# Altium project PCB_Project.PrjPcb (part 9 of 11)
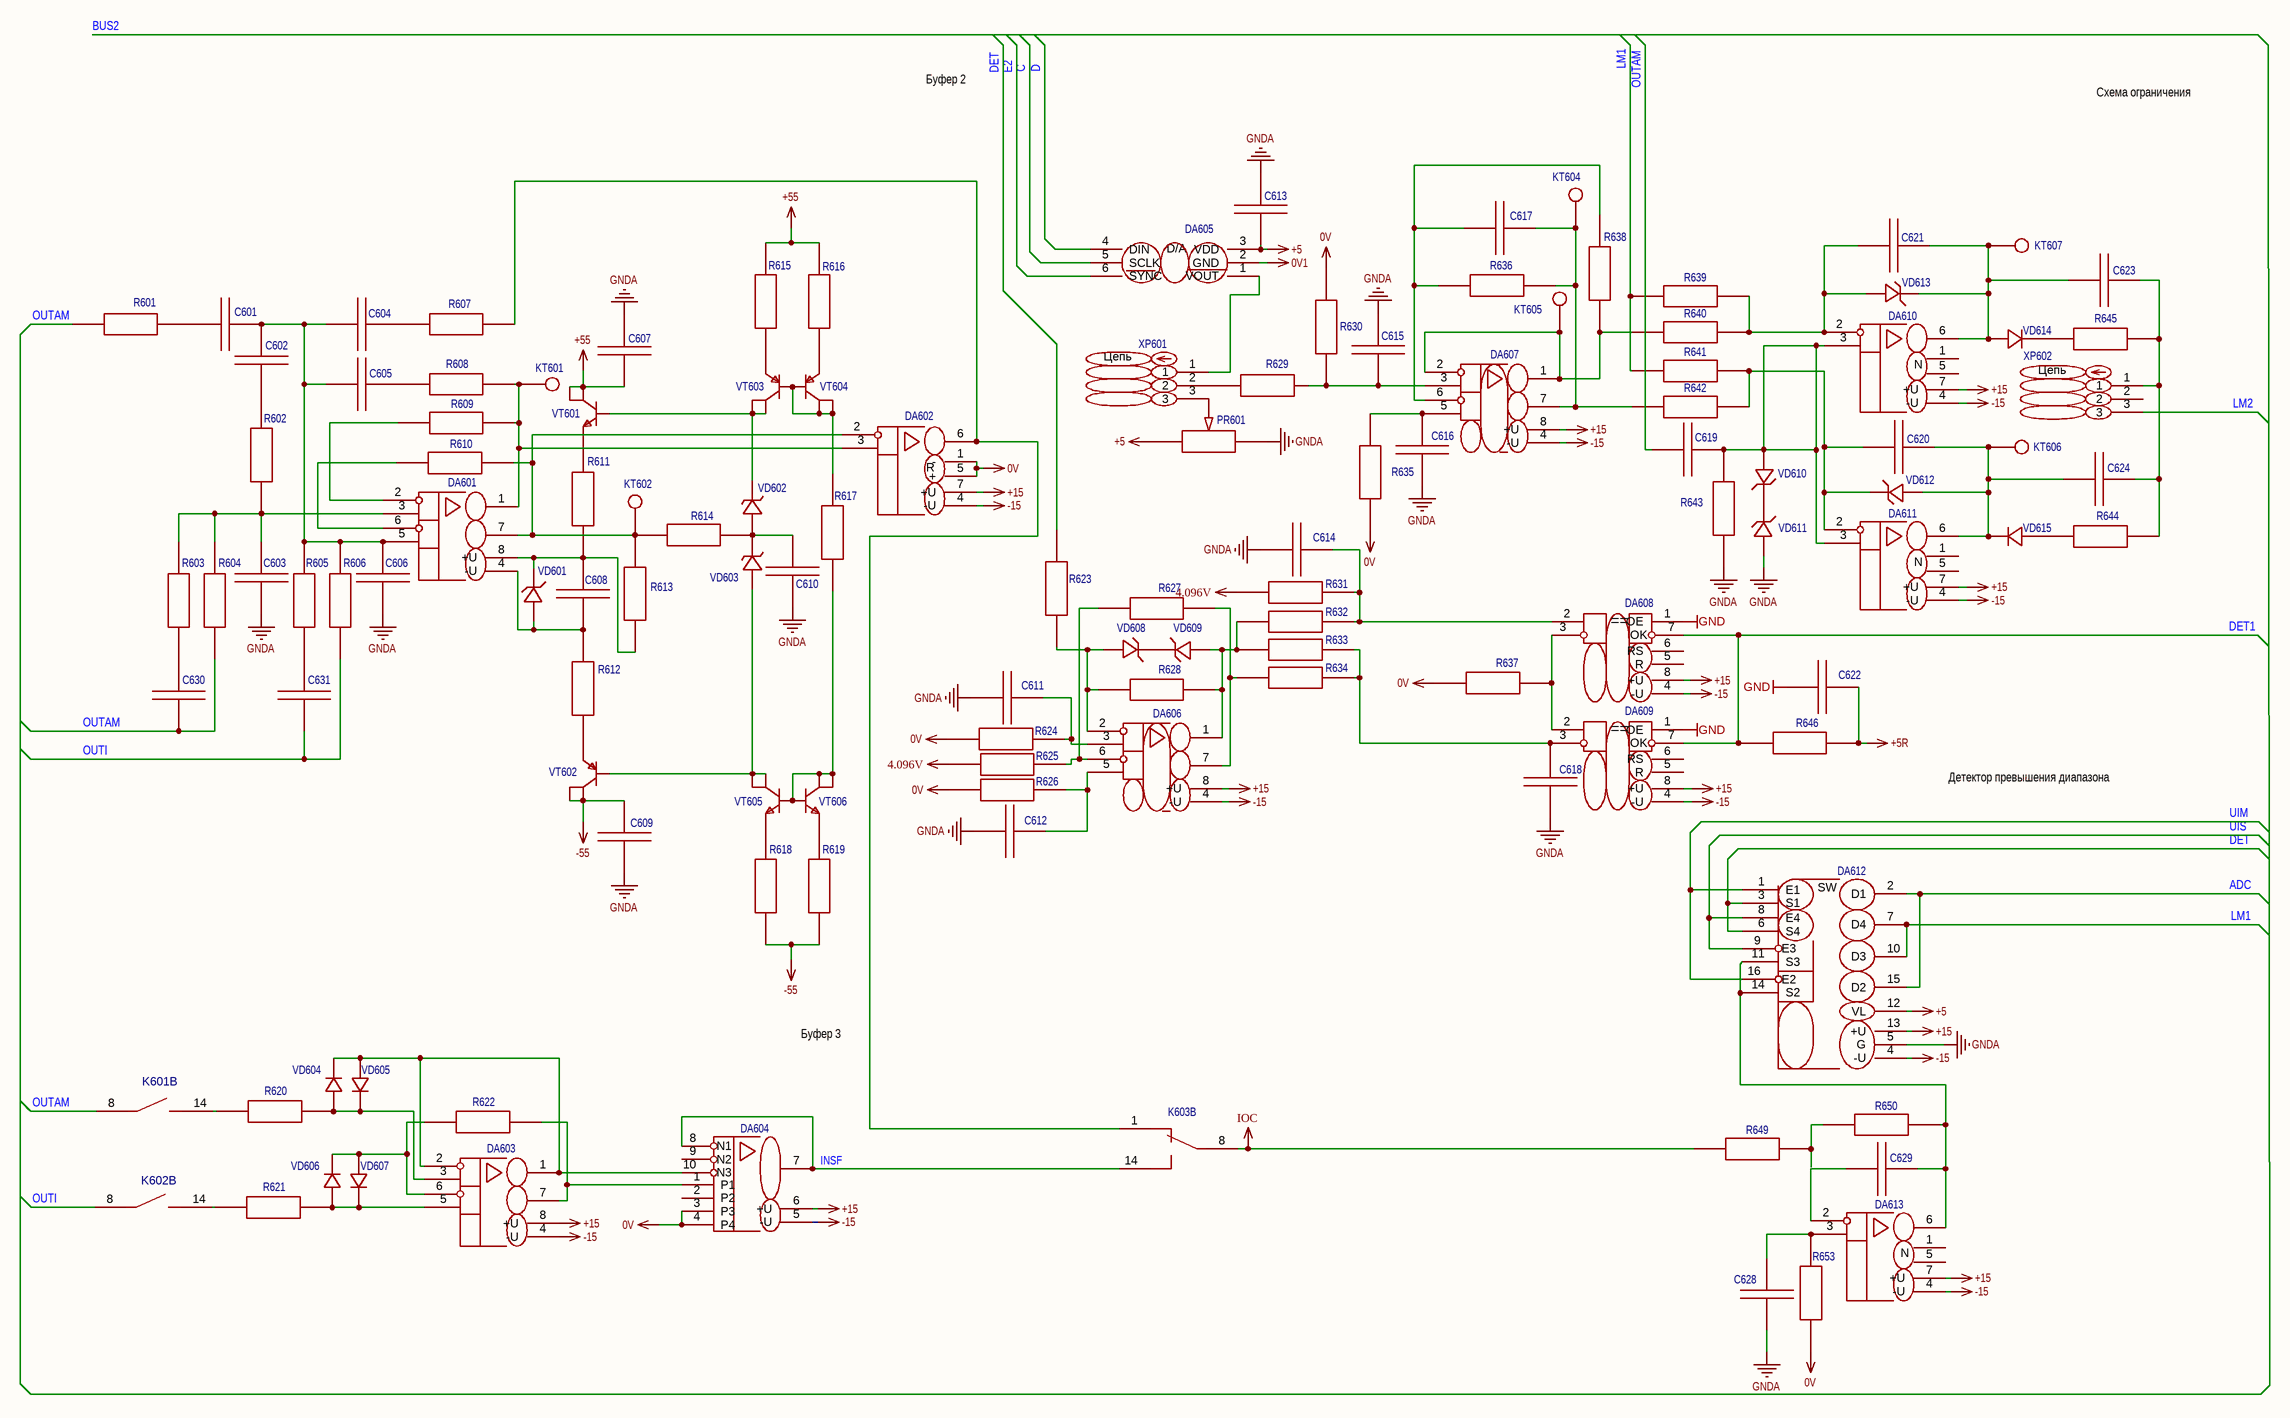
[diagram p12: УШЯИ.411618.029Э Э3 Лист 6.schdoc]

## Sheet УШЯИ.411618.029Э Э3 Лист 6.schdoc (continued)
### Library data of the parts
C601 = Конденсатор SMD 6,8пФ 100В X7R 10% [0805]: Origin Footprint: C0805; Contributor: jordanjin; Convert to PCB: yes; UniqueId: gge09fd117a0856f8e0; Device: Конденсатор SMD 6,8пФ 100В X7R 10% [0805]; Symbol: Конденсатор SMD 6,8пФ 100В X7R 10% [0805]; Manufacturer Part: C0805; Add into BOM: yes; spicePre: C; spiceSymbolName: Конденсатор К10-17Б М47 33пФ NP0 5% [DIP]; FootprintName: C0805
C602 = Конденсатор SMD 10пФ 100В X7R 10% [0805]: Origin Footprint: C0805; Contributor: jordanjin; Convert to PCB: yes; UniqueId: gged3e8d81935ac7a73; Device: Конденсатор SMD 10пФ 100В X7R 10% [0805]; Symbol: Конденсатор SMD 10пФ 100В X7R 10% [0805]; Manufacturer Part: C0805; Add into BOM: yes; spicePre: C; spiceSymbolName: Конденсатор К10-17Б М47 33пФ NP0 5% [DIP]; FootprintName: C0805
C603 = Конденсатор SMD 15пФ 100В X7R 10% [0805]: Contributor: jordanjin; Convert to PCB: yes; UniqueId: gge2181f9b3c6e2bb1e; Origin Footprint: C0805; Device: Конденсатор SMD 15пФ 100В X7R 10% [0805]; Symbol: Конденсатор SMD 15пФ 100В X7R 10% [0805]; Manufacturer Part: C0805; Add into BOM: yes; spicePre: C; spiceSymbolName: Конденсатор К10-17Б М47 33пФ NP0 5% [DIP]; FootprintName: C0805
C604 = Конденсатор SMD 10пФ 100В X7R 10% [0805]: Origin Footprint: C0805; Contributor: jordanjin; Convert to PCB: yes; UniqueId: ggeafb1d56235e31cae; Device: Конденсатор SMD 10пФ 100В X7R 10% [0805]; Symbol: Конденсатор SMD 10пФ 100В X7R 10% [0805]; Manufacturer Part: C0805; Add into BOM: yes; spicePre: C; spiceSymbolName: Конденсатор К10-17Б М47 33пФ NP0 5% [DIP]; FootprintName: C0805
C605 = Конденсатор SMD 10пФ 100В X7R 10% [0805]: Origin Footprint: C0805; Contributor: jordanjin; Convert to PCB: yes; UniqueId: ggee318a1989ed5d308; Device: Конденсатор SMD 10пФ 100В X7R 10% [0805]; Symbol: Конденсатор SMD 10пФ 100В X7R 10% [0805]; Manufacturer Part: C0805; Add into BOM: yes; spicePre: C; spiceSymbolName: Конденсатор К10-17Б М47 33пФ NP0 5% [DIP]; FootprintName: C0805
C606 = Конденсатор SMD 15пФ 100В X7R 10% [0805]: Origin Footprint: C0805; Contributor: jordanjin; Convert to PCB: yes; UniqueId: ggeecdc17a04e6afe0f; Device: Конденсатор SMD 15пФ 100В X7R 10% [0805]; Symbol: Конденсатор SMD 15пФ 100В X7R 10% [0805]; Manufacturer Part: C0805; Add into BOM: yes; spicePre: C; spiceSymbolName: Конденсатор К10-17Б М47 33пФ NP0 5% [DIP]; FootprintName: C0805
C607 = Конденсатор SMD 0,068мкФ 100В X7R 10% [0805]: Contributor: jordanjin; Convert to PCB: yes; UniqueId: gged7f2fa0948b0371b; Origin Footprint: C0805; Device: Конденсатор SMD 0,068мкФ 100В X7R 10% [0805]; Symbol: Конденсатор SMD 0,068мкФ 100В X7R 10% [0805]; Manufacturer Part: C0805; Add into BOM: yes; spicePre: C; spiceSymbolName: Конденсатор SMD 100нФ 100В X7R 10% [0805]; FootprintName: C0805
C608 = Конденсатор SMD 5600пФ 100В X7R 10% [0805]: Contributor: jordanjin; Convert to PCB: yes; UniqueId: gge224f8635dbcd514c; Origin Footprint: C0805; Device: Конденсатор SMD 5600пФ 100В X7R 10% [0805]; Symbol: Конденсатор SMD 5600пФ 100В X7R 10% [0805]; Manufacturer Part: C0805; Add into BOM: yes; spicePre: C; spiceSymbolName: Конденсатор SMD 100нФ 100В X7R 10% [0805]; FootprintName: C0805
C609 = Конденсатор SMD 0,068мкФ 100В X7R 10% [0805]: Contributor: jordanjin; Convert to PCB: yes; UniqueId: ggeb3c1d11995165365; Origin Footprint: C0805; Device: Конденсатор SMD 0,068мкФ 100В X7R 10% [0805]; Symbol: Конденсатор SMD 0,068мкФ 100В X7R 10% [0805]; Manufacturer Part: C0805; Add into BOM: yes; spicePre: C; spiceSymbolName: Конденсатор SMD 100нФ 100В X7R 10% [0805]; FootprintName: C0805
C610 = Конденсатор SMD 100пФ 100В X7R 10% [0805]: Contributor: jordanjin; Convert to PCB: yes; UniqueId: ggee613cc0ccdf2f974; Origin Footprint: C0805; Device: Конденсатор SMD 100пФ 100В X7R 10% [0805]; Symbol: Конденсатор SMD 100пФ 100В X7R 10% [0805]; Manufacturer Part: C0805; Add into BOM: yes; spicePre: C; spiceSymbolName: Конденсатор SMD 100нФ 100В X7R 10% [0805]; FootprintName: C0805
C611 = Конденсатор SMD 9100пФ 100В X7R 10% [0805]: Contributor: jordanjin; Convert to PCB: yes; UniqueId: gged8c8c588d7ab512f; Origin Footprint: C0805; Device: Конденсатор SMD 9100пФ 100В X7R 10% [0805]; Symbol: Конденсатор SMD 9100пФ 100В X7R 10% [0805]; Manufacturer Part: C0805; spicePre: C; spiceSymbolName: Конденсатор SMD 100нФ 100В X7R 10% [0805]; Add into BOM: yes; FootprintName: C0805
C612 = Конденсатор SMD 9100пФ 100В X7R 10% [0805]: Contributor: jordanjin; Convert to PCB: yes; UniqueId: ggeea1fd01efbae17f5; Origin Footprint: C0805; Device: Конденсатор SMD 9100пФ 100В X7R 10% [0805]; Symbol: Конденсатор SMD 9100пФ 100В X7R 10% [0805]; Manufacturer Part: C0805; spicePre: C; spiceSymbolName: Конденсатор SMD 100нФ 100В X7R 10% [0805]; Add into BOM: yes; FootprintName: C0805
C613 = Конденсатор SMD 0,33мкФ 100В X7R 10% [0805]: Contributor: jordanjin; Convert to PCB: yes; UniqueId: gge11220b9d5fb08c95; Origin Footprint: C0805; Device: Конденсатор SMD 0,33мкФ 100В X7R 10% [0805]; Symbol: Конденсатор SMD 0,33мкФ 100В X7R 10% [0805]; Manufacturer Part: C0805; spicePre: C; spiceSymbolName: Конденсатор SMD 100нФ 100В X7R 10% [0805]; Add into BOM: yes; FootprintName: C0805
C614 = Конденсатор SMD 0,33мкФ 100В X7R 10% [0805]: Contributor: jordanjin; Convert to PCB: yes; UniqueId: gge1c8d724e312b948d; Origin Footprint: C0805; Device: Конденсатор SMD 0,33мкФ 100В X7R 10% [0805]; Symbol: Конденсатор SMD 0,33мкФ 100В X7R 10% [0805]; Manufacturer Part: C0805; spicePre: C; spiceSymbolName: Конденсатор SMD 100нФ 100В X7R 10% [0805]; Add into BOM: yes; FootprintName: C0805
C615 = Конденсатор SMD 9100пФ 100В X7R 10% [0805]: Contributor: jordanjin; Convert to PCB: yes; UniqueId: gge66e6ed0f0da9b8ab; Origin Footprint: C0805; Device: Конденсатор SMD 9100пФ 100В X7R 10% [0805]; Symbol: Конденсатор SMD 9100пФ 100В X7R 10% [0805]; Manufacturer Part: C0805; spicePre: C; spiceSymbolName: Конденсатор SMD 100нФ 100В X7R 10% [0805]; Add into BOM: yes; FootprintName: C0805
C616 = Конденсатор SMD 9100пФ 100В X7R 10% [0805]: Contributor: jordanjin; Convert to PCB: yes; UniqueId: ggebc9eb3afc720025c; Origin Footprint: C0805; Device: Конденсатор SMD 9100пФ 100В X7R 10% [0805]; Symbol: Конденсатор SMD 9100пФ 100В X7R 10% [0805]; Manufacturer Part: C0805; spicePre: C; spiceSymbolName: Конденсатор SMD 100нФ 100В X7R 10% [0805]; Add into BOM: yes; FootprintName: C0805
C617 = Конденсатор SMD 33пФ 100В X7R 10% [0805]: Contributor: jordanjin; Convert to PCB: yes; UniqueId: ggef83e3dbe73bcc716; Origin Footprint: C0805; Device: Конденсатор SMD 33пФ 100В X7R 10% [0805]; Symbol: Конденсатор SMD 33пФ 100В X7R 10% [0805]; Manufacturer Part: C0805; spicePre: C; spiceSymbolName: Конденсатор SMD 100нФ 100В X7R 10% [0805]; Add into BOM: yes; FootprintName: C0805
C618 = Конденсатор SMD 9100пФ 100В X7R 10% [0805]: Origin Footprint: C0805; Contributor: jordanjin; Convert to PCB: yes; UniqueId: gge7a02d01bed751451; Device: Конденсатор SMD 9100пФ 100В X7R 10% [0805]; Symbol: Конденсатор SMD 9100пФ 100В X7R 10% [0805]; Manufacturer Part: C0805; spicePre: C; spiceSymbolName: Конденсатор SMD 100нФ 100В X7R 10% [0805]; Add into BOM: yes; FootprintName: C0805
C619 = Конденсатор SMD 240пФ 100В X7R 10% [0805]: Origin Footprint: C0805; Contributor: jordanjin; Convert to PCB: yes; UniqueId: gge51635db8f8e15c09; Device: Конденсатор SMD 240пФ 100В X7R 10% [0805]; Symbol: Конденсатор SMD 240пФ 100В X7R 10% [0805]; Manufacturer Part: C0805; spicePre: C; spiceSymbolName: Конденсатор SMD 100нФ 100В X7R 10% [0805]; Add into BOM: yes; FootprintName: C0805
C620 = Конденсатор SMD 680пФ 100В X7R 10% [0805]: Contributor: jordanjin; Convert to PCB: yes; UniqueId: gge534c38f266f102c6; Origin Footprint: C0805; Device: Конденсатор SMD 680пФ 100В X7R 10% [0805]; Symbol: Конденсатор SMD 680пФ 100В X7R 10% [0805]; Manufacturer Part: C0805; spicePre: C; spiceSymbolName: Конденсатор SMD 100нФ 100В X7R 10% [0805]; Add into BOM: yes; FootprintName: C0805
C621 = Конденсатор SMD 680пФ 100В X7R 10% [0805]: Contributor: jordanjin; Convert to PCB: yes; UniqueId: gge9e5cd09579cbec99; Origin Footprint: C0805; Device: Конденсатор SMD 680пФ 100В X7R 10% [0805]; Symbol: Конденсатор SMD 680пФ 100В X7R 10% [0805]; Manufacturer Part: C0805; spicePre: C; spiceSymbolName: Конденсатор SMD 100нФ 100В X7R 10% [0805]; Add into BOM: yes; FootprintName: C0805
C622 = Конденсатор SMD 0,33мкФ 100В X7R 10% [0805]: Contributor: jordanjin; Convert to PCB: yes; UniqueId: ggec2a1fdf08b456d83; Origin Footprint: C0805; Device: Конденсатор SMD 0,33мкФ 100В X7R 10% [0805]; Symbol: Конденсатор SMD 0,33мкФ 100В X7R 10% [0805]; Manufacturer Part: C0805; spicePre: C; spiceSymbolName: Конденсатор SMD 100нФ 100В X7R 10% [0805]; Add into BOM: yes; FootprintName: C0805
C623 = Конденсатор SMD 100нФ В X7R 10% [0805]: Contributor: jordanjin; Convert to PCB: yes; UniqueId: gge516ca53ccaa11f5d; Origin Footprint: C0805; Device: Конденсатор SMD 100нФ В X7R 10% [0805]; Symbol: Конденсатор SMD 100нФ В X7R 10% [0805]; Manufacturer Part: C0805; spicePre: C; spiceSymbolName: Конденсатор SMD 100нФ 100В X7R 10% [0805]; Add into BOM: yes; FootprintName: C0805
C624 = Конденсатор SMD 100нФ В X7R 10% [0805]: Contributor: jordanjin; Convert to PCB: yes; UniqueId: gge64ab5350e3238cc7; Origin Footprint: C0805; Device: Конденсатор SMD 100нФ В X7R 10% [0805]; Symbol: Конденсатор SMD 100нФ В X7R 10% [0805]; Manufacturer Part: C0805; spicePre: C; spiceSymbolName: Конденсатор SMD 100нФ 100В X7R 10% [0805]; Add into BOM: yes; FootprintName: C0805
C628 = Конденсатор SMD 51пФ 100В X7R 10% [0805]: Contributor: jordanjin; Convert to PCB: yes; UniqueId: gge7c3d1d350e749c86; Origin Footprint: C0805; Device: Конденсатор SMD 51пФ 100В X7R 10% [0805]; Symbol: Конденсатор SMD 51пФ 100В X7R 10% [0805]; Manufacturer Part: C0805; Add into BOM: yes; spicePre: C; spiceSymbolName: Конденсатор SMD 100нФ 100В X7R 10% [0805]; FootprintName: C0805
C629 = Конденсатор SMD 33пФ 100В X7R 10% [0805]: Contributor: jordanjin; Convert to PCB: yes; UniqueId: gge2dcc97cb1bee371f; Origin Footprint: C0805; Device: Конденсатор SMD 33пФ 100В X7R 10% [0805]; Symbol: Конденсатор SMD 33пФ 100В X7R 10% [0805]; Manufacturer Part: C0805; Add into BOM: yes; spicePre: C; spiceSymbolName: Конденсатор SMD 100нФ 100В X7R 10% [0805]; FootprintName: C0805
C630 = Конденсатор SMD 22пФ 100В X7R 10% [0805]: Contributor: jordanjin; Convert to PCB: yes; UniqueId: gge24bdeba23e4fca19; Origin Footprint: C0805; Device: Конденсатор SMD 22пФ 100В X7R 10% [0805]; Symbol: Конденсатор SMD 22пФ 100В X7R 10% [0805]; Manufacturer Part: C0805; Add into BOM: yes; spicePre: C; spiceSymbolName: Конденсатор SMD 100нФ 100В X7R 10% [0805]; FootprintName: C0805
C631 = Конденсатор SMD 10пФ 100В X7R 10% [0805]: Contributor: jordanjin; Convert to PCB: yes; UniqueId: ggeefaf12054448ba76; Origin Footprint: C0805; Device: Конденсатор SMD 10пФ 100В X7R 10% [0805]; Symbol: Конденсатор SMD 10пФ 100В X7R 10% [0805]; Manufacturer Part: C0805; Add into BOM: yes; spicePre: C; spiceSymbolName: Конденсатор SMD 100нФ 100В X7R 10% [0805]; FootprintName: C0805
DA601 = Операционный усилитель TLV9152IDR [SOIC-8]: subpart_no: 1; Manufacturer: TI; Contributor: jordanjin; Convert to PCB: yes; UniqueId: ggeaaff039b8b8c6cf1; Origin Footprint: SOIC-8_L4.9-W3.9-P1.27-LS6.0-BL; Device: Операционный усилитель TLV9152IDR [SOIC-8]; Symbol: Операционный усилитель TLV9152IDR [SOIC-8]; Supplier: LCSC; Manufacturer Part: TLV9152IDR; JLCPCB Part Class: Extended Part; spicePre: D; spiceSymbolName: Операционный усилитель TLV9152IDR [SOIC-8]; Add into BOM: yes; FootprintName: SOIC-8_L4.9-W3.9-P1.27-LS6.0-BL
DA602 = Операционный усилитель AD629BN [DIP-8]: Manufacturer: Analog Devices; Contributor: jordanjin; Convert to PCB: yes; UniqueId: gge075528edad604e4a; ModelId: cd43acd6bbcd489d94be674de5285ecf; Origin Footprint: PDIP-8_L9.6-W6.4-P2.54-LS7.6-BL-1; Device: Операционный усилитель AD629BN [DIP-8]; Symbol: Операционный усилитель AD629BN [DIP-8]; Supplier: LCSC; Manufacturer Part: AD629BN; JLCPCB Part Class: Extended Part; spicePre: D; spiceSymbolName: Операционный усилитель AD629BN [DIP-8]; Add into BOM: yes; FootprintName: PDIP-8_L9.6-W6.4-P2.54-LS7.6-BL-1; ModelName: PDIP-8_L9.6-W6.4-P2.54-LS7.6-BL-1
DA603 = Операционный усилитель AD8512ARZ [SOIC-8]: subpart_no: 1; Manufacturer: Analog Devices; Contributor: jordanjin; Convert to PCB: yes; UniqueId: ggeced3b0461d8328b2; Origin Footprint: SOIC-8_L4.9-W3.9-P1.27-LS6.0-BL; Device: Операционный усилитель AD8512ARZ [SOIC-8]; Symbol: Операционный усилитель AD8512ARZ [SOIC-8]; Supplier: LCSC; Manufacturer Part: AD8512ARZ; JLCPCB Part Class: Extended Part; spicePre: D; spiceSymbolName: Операционный усилитель AD8512ARZ [SOIC-8]; Add into BOM: yes; FootprintName: SOIC-8_L4.9-W3.9-P1.27-LS6.0-BL
DA604 = Операционный усилитель AD8271 [MSOP-10]: Manufacturer: Analog Devices; Manufacturer Part: AD8271BRMZ; Contributor: jordanjin; Convert to PCB: yes; UniqueId: gge974dbd124a420eef; Origin Footprint: MSOP-10_L3.0-W3.0-P0.50-LS5.0-BL; Device: Операционный усилитель AD8271 [MSOP-10]; Symbol: Операционный усилитель AD8271 [MSOP-10]; Supplier: LCSC; JLCPCB Part Class: Extended Part; spicePre: D; spiceSymbolName: Операционный усилитель AD8271 [MSOP-10]; Add into BOM: yes; FootprintName: MSOP-10_L3.0-W3.0-P0.50-LS5.0-BL
DA605 = Цифроаналоговый преобразователь AD5300BRTZ [SOT-23-6]: Manufacturer: Analog Devices; Manufacturer Part: AD5300BRTZ-REEL7; Contributor: jordanjin; Convert to PCB: yes; UniqueId: ggee9156f031132c62c; Origin Footprint: SOT-23-6_L2.9-W1.6-P0.95-LS2.8-BL; Device: Цифроаналоговый преобразователь AD5300BRTZ [SOT-23-6]; Symbol: Цифроаналоговый преобразователь AD5300BRTZ [SOT-23-6]; Supplier: LCSC; JLCPCB Part Class: Extended Part; spicePre: D; spiceSymbolName: Цифроаналоговый преобразователь AD5300BRTZ [SOT-23-6]; Add into BOM: yes; FootprintName: SOT-23-6_L2.9-W1.6-P0.95-LS2.8-BL
DA606 = Операционный усилитель AD8672ARZ [SOIC-8]: Manufacturer: Analog Devices; Manufacturer Part: AD8672ARZ-REEL7; Contributor: jordanjin; Convert to PCB: yes; UniqueId: gge6c9466a76004a78f; Origin Footprint: SOIC-8_L4.9-W3.9-P1.27-LS6.0-BL; Device: Операционный усилитель AD8672ARZ [SOIC-8]; Symbol: Операционный усилитель AD8672ARZ [SOIC-8]; Supplier: LCSC; Supplier Part: C56309; JLCPCB Part Class: Extended Part; spicePre: D; spiceSymbolName: Операционный усилитель AD8672ARZ [SOIC-8]; Add into BOM: yes; FootprintName: SOIC-8_L4.9-W3.9-P1.27-LS6.0-BL
DA607 = Операционный усилитель AD8672ARZ [SOIC-8]: Manufacturer: Analog Devices; Manufacturer Part: AD8672ARZ-REEL7; Contributor: jordanjin; Convert to PCB: yes; UniqueId: ggee6634572b7f12d52; Origin Footprint: SOIC-8_L4.9-W3.9-P1.27-LS6.0-BL; Device: Операционный усилитель AD8672ARZ [SOIC-8]; Symbol: Операционный усилитель AD8672ARZ [SOIC-8]; Supplier: LCSC; Supplier Part: C56309; JLCPCB Part Class: Extended Part; spicePre: D; spiceSymbolName: Операционный усилитель AD8672ARZ [SOIC-8]; Add into BOM: yes; FootprintName: SOIC-8_L4.9-W3.9-P1.27-LS6.0-BL
DA608 = Компаратор КР554СА3А [DIP-8]: Contributor: jordanjin; Convert to PCB: yes; UniqueId: gge40a82c4234872fa6; ModelId: a08c44e4e7b5483b85454123c2c7d395; Origin Footprint: DIP-8_L9.7-W6.4-P2.54-LS7.6-BL-1; Device: Компаратор КР554СА3А [DIP-8]; Symbol: Компаратор КР554СА3А [DIP-8]; Manufacturer Part: КР554СА3А; spicePre: D; spiceSymbolName: Компаратор КР554СА3А [DIP-8]; Add into BOM: yes; FootprintName: DIP-8_L9.7-W6.4-P2.54-LS7.6-BL-1; ModelName: DIP-8_L9.7-W6.4-P2.54-LS7.6-BL-1
DA609 = Компаратор КР554СА3А [DIP-8]: Contributor: jordanjin; Convert to PCB: yes; UniqueId: gged65ffbd1354557b5; ModelId: a08c44e4e7b5483b85454123c2c7d395; Origin Footprint: DIP-8_L9.7-W6.4-P2.54-LS7.6-BL-1; Device: Компаратор КР554СА3А [DIP-8]; Symbol: Компаратор КР554СА3А [DIP-8]; Manufacturer Part: КР554СА3А; spicePre: D; spiceSymbolName: Компаратор КР554СА3А [DIP-8]; Add into BOM: yes; FootprintName: DIP-8_L9.7-W6.4-P2.54-LS7.6-BL-1; ModelName: DIP-8_L9.7-W6.4-P2.54-LS7.6-BL-1
DA610 = Операционный усилитель ADA4627-1BRZ [SOIC-8]: Manufacturer: Analog Devices; Contributor: jordanjin; Convert to PCB: yes; UniqueId: gge8da6564329f396c6; ModelId: 08ee08ca4db744298953d7a1ad16709b; Origin Footprint: SOIC-8_L5.0-W4.0-P1.27-LS6.1-BL; Device: Операционный усилитель ADA4627-1BRZ [SOIC-8]; Symbol: Операционный усилитель ADA4627-1BRZ [SOIC-8]; Supplier: LCSC; Manufacturer Part: ADA4627-1BRZ; JLCPCB Part Class: Extended Part; spicePre: D; spiceSymbolName: Операционный усилитель ADA4627-1BRZ [SOIC-8]; Add into BOM: yes; FootprintName: SOIC-8_L5.0-W4.0-P1.27-LS6.1-BL; ModelName: SOIC-8_L5.0-W4.0-P1.27-LS6.1-BL
DA611 = Операционный усилитель ADA4627-1BRZ [SOIC-8]: Manufacturer: Analog Devices; Contributor: jordanjin; Convert to PCB: yes; UniqueId: ggeb3eaa57faad20ba4; ModelId: 08ee08ca4db744298953d7a1ad16709b; Origin Footprint: SOIC-8_L5.0-W4.0-P1.27-LS6.1-BL; Device: Операционный усилитель ADA4627-1BRZ [SOIC-8]; Symbol: Операционный усилитель ADA4627-1BRZ [SOIC-8]; Supplier: LCSC; Manufacturer Part: ADA4627-1BRZ; JLCPCB Part Class: Extended Part; spicePre: D; spiceSymbolName: Операционный усилитель ADA4627-1BRZ [SOIC-8]; Add into BOM: yes; FootprintName: SOIC-8_L5.0-W4.0-P1.27-LS6.1-BL; ModelName: SOIC-8_L5.0-W4.0-P1.27-LS6.1-BL
DA612 = Коммутатор аналоговых сигналов ADG433BRZ [SOIC-16]: Manufacturer: Analog Devices; Manufacturer Part: ADG433BRZ-REEL; Contributor: jordanjin; Convert to PCB: yes; UniqueId: gge8ed74c2802593459; Origin Footprint: SOIC-16_L9.9-W3.9-P1.27-LS6.0-BL; Device: Коммутатор аналоговых сигналов ADG433BRZ [SOIC-16]; Symbol: Коммутатор аналоговых сигналов ADG433BRZ [SOIC-16]; Supplier: LCSC; Supplier Part: C655338; JLCPCB Part Class: Extended Part; spicePre: D; spiceSymbolName: Коммутатор аналоговых сигналов ADG433BRZ [SOIC-16]; Add into BOM: yes; FootprintName: SOIC-16_L9.9-W3.9-P1.27-LS6.0-BL
DA613 = Операционный усилитель ADA4627-1BRZ [SOIC-8]: Manufacturer: Analog Devices; Contributor: jordanjin; Convert to PCB: yes; UniqueId: gge581cf98f1f47a8f1; ModelId: 08ee08ca4db744298953d7a1ad16709b; Origin Footprint: SOIC-8_L5.0-W4.0-P1.27-LS6.1-BL; Device: Операционный усилитель ADA4627-1BRZ [SOIC-8]; Symbol: Операционный усилитель ADA4627-1BRZ [SOIC-8]; Supplier: LCSC; Manufacturer Part: ADA4627-1BRZ; JLCPCB Part Class: Extended Part; spicePre: D; spiceSymbolName: Операционный усилитель ADA4627-1BRZ [SOIC-8]; Add into BOM: yes; FootprintName: SOIC-8_L5.0-W4.0-P1.27-LS6.1-BL; ModelName: SOIC-8_L5.0-W4.0-P1.27-LS6.1-BL
K601#2 = Реле герконовое DIP05-1A72-13L  [PCB]: Manufacturer: STANDEXMEDER; subpart_no: 2; Origin Footprint: RELAY-TH_STANDEXMEDER_DIP05-1A72-13L; Contributor: jordanjin; Convert to PCB: yes; UniqueId: gge51807c597b1384e9; Device: Реле герконовое DIP05-1A72-13L  [PCB]; Symbol: Реле герконовое DIP05-1A72-13L  [PCB]; Supplier: LCSC; Supplier Part: C1524853; Manufacturer Part: DIP05-1A72-13L; JLCPCB Part Class: Extended Part; spicePre: K; spiceSymbolName: Реле герконовое DIP05-1A72-13L  [PCB]; Add into BOM: yes; FootprintName: RELAY-TH_STANDEXMEDER_DIP05-1A72-13L
K602#2 = Реле герконовое DIP05-1A72-13L  [PCB]: Manufacturer: STANDEXMEDER; subpart_no: 1; Origin Footprint: RELAY-TH_STANDEXMEDER_DIP05-1A72-13L; Contributor: jordanjin; Convert to PCB: yes; UniqueId: gge52733196f8edc868; Device: Реле герконовое DIP05-1A72-13L  [PCB]; Symbol: Реле герконовое DIP05-1A72-13L  [PCB]; Supplier: LCSC; Supplier Part: C1524853; Manufacturer Part: DIP05-1A72-13L; JLCPCB Part Class: Extended Part; spicePre: K; spiceSymbolName: Реле герконовое DIP05-1A72-13L  [PCB]; Add into BOM: yes; FootprintName: RELAY-TH_STANDEXMEDER_DIP05-1A72-13L
K603 = Реле герконовое DIP05-1C90-51L [PCB]: Manufacturer: STANDEXMEDER; subpart_no: 2; Origin Footprint: RELAY-TH_STANDEXMEDER_DIP05-1C90-51L; Contributor: jordanjin; Convert to PCB: yes; UniqueId: ggeb24c0cbb939d251f; ModelId: 9ce20f042c4243a9be1ebcff3b9f4bf9; Device: Реле герконовое DIP05-1C90-51L [PCB]; Symbol: Реле герконовое DIP05-1C90-51L [PCB]; Supplier: LCSC; Manufacturer Part: DIP05-1C90-51L; JLCPCB Part Class: Extended Part; spicePre: K; spiceSymbolName: Реле герконовое DIP05-1C90-51L [PCB]; Add into BOM: yes; FootprintName: RELAY-TH_STANDEXMEDER_DIP05-1C90-51L; ModelName: RELAY-TH_STANDEXMEDER_DIP05-1C90-51L
KT601 = Control point: Contributor: jordanjin; Convert to PCB: yes; UniqueId: ggeff07f407c283f191; Origin Footprint: CONTROL POINT; Device: Control point; Symbol: Control point; Manufacturer Part: Control point; spicePre: K; spiceSymbolName: Control point; Add into BOM: yes
KT602 = Control point: Contributor: jordanjin; Convert to PCB: yes; UniqueId: gge7a24e8b470d7bdee; Origin Footprint: CONTROL POINT; Device: Control point; Symbol: Control point; Manufacturer Part: Control point; spicePre: K; spiceSymbolName: Control point; Add into BOM: yes
KT604 = Control point: Contributor: jordanjin; Convert to PCB: yes; UniqueId: ggecff9ea9ceb979317; Origin Footprint: CONTROL POINT; Device: Control point; Symbol: Control point; Manufacturer Part: Control point; spicePre: K; spiceSymbolName: Control point; Add into BOM: yes
KT605 = Control point: Contributor: jordanjin; Convert to PCB: yes; UniqueId: gge4cd489995e175387; Origin Footprint: CONTROL POINT; Device: Control point; Symbol: Control point; Manufacturer Part: Control point; spicePre: K; spiceSymbolName: Control point; Add into BOM: yes
KT606 = Control point: Contributor: jordanjin; Convert to PCB: yes; UniqueId: ggeb14cbe2f1ff666e4; Origin Footprint: CONTROL POINT; Device: Control point; Symbol: Control point; Manufacturer Part: Control point; spicePre: K; spiceSymbolName: Control point; Add into BOM: yes
KT607 = Control point: Contributor: jordanjin; Convert to PCB: yes; UniqueId: ggea88355899b9db832; Origin Footprint: CONTROL POINT; Device: Control point; Symbol: Control point; Manufacturer Part: Control point; spicePre: K; spiceSymbolName: Control point; Add into BOM: yes
PR601 = 47кОм: Manufacturer: BOCHEN; Manufacturer Part: 3329H; nameAlias: Value; Contributor: jordanjin; Convert to PCB: yes; UniqueId: gge1fcb3b6f1d9b0ac2; ModelId: 23beb460a8f44fd4bbfb4488e320892f; Origin Footprint: RES-ADJ-TH_3329H; Device: 47кОм; Symbol: 47кОм; Supplier: LCSC; JLCPCB Part Class: Extended Part; spicePre: R; spiceSymbolName: Резистор подстроречный 47кОм [3329H]; Add into BOM: yes; Resistance: 47кОм; FootprintName: RES-ADJ-TH_3329H; ModelName: RES-ADJ-TH_3329H
R601 = Резистор 51кОм 0,125Вт 1% [0805]: Contributor: jordanjin; Convert to PCB: yes; UniqueId: gge4604ba15f86cf68d; ModelId: de27d504f5024d53a3020ec2611f5e5e; Origin Footprint: R0805; Device: Резистор 51кОм 0,125Вт 1% [0805]; Symbol: Резистор 51кОм 0,125Вт 1% [0805]; Manufacturer Part: R0805; spicePre: R; spiceSymbolName: Резистор 12кОм 0,125Вт 1% [0805]; Add into BOM: yes; FootprintName: R0805; ModelName: R0805
R602 = Резистор 12кОм 0,125Вт 1% [0805]: Contributor: jordanjin; Convert to PCB: yes; UniqueId: gge47a2f8a68284927c; ModelId: de27d504f5024d53a3020ec2611f5e5e; Origin Footprint: R0805; Device: Резистор 12кОм 0,125Вт 1% [0805]; Symbol: Резистор 12кОм 0,125Вт 1% [0805]; Manufacturer Part: R0805; spicePre: R; spiceSymbolName: Резистор 12кОм 0,125Вт 1% [0805]; Add into BOM: yes; FootprintName: R0805; ModelName: R0805
R603 = Резистор 5,1кОм 0,125Вт 1% [0805]: Contributor: jordanjin; Convert to PCB: yes; UniqueId: ggea61903ee3859a208; ModelId: de27d504f5024d53a3020ec2611f5e5e; Origin Footprint: R0805; Device: Резистор 5,1кОм 0,125Вт 1% [0805]; Symbol: Резистор 5,1кОм 0,125Вт 1% [0805]; Manufacturer Part: R0805; spicePre: R; spiceSymbolName: Резистор 12кОм 0,125Вт 1% [0805]; Add into BOM: yes; FootprintName: R0805; ModelName: R0805
R604 = Резистор 301кОм 0.25Вт 1% [1206]: Contributor: jordanjin; Convert to PCB: yes; UniqueId: gge0e4eb32b7003baab; Origin Footprint: R1206; Device: Резистор 301кОм 0.25Вт 1% [1206]; Symbol: Резистор 301кОм 0.25Вт 1% [1206]; Manufacturer Part: R1206; spicePre: R; spiceSymbolName: Резистор 12кОм 0,25Вт 1% [1206]; Add into BOM: yes; FootprintName: R1206
R605 = Резистор 5,1кОм 0,125Вт 1% [0805]: Origin Footprint: R0805; Contributor: jordanjin; Convert to PCB: yes; UniqueId: ggebdaec917f4fe59c2; ModelId: de27d504f5024d53a3020ec2611f5e5e; Device: Резистор 5,1кОм 0,125Вт 1% [0805]; Symbol: Резистор 5,1кОм 0,125Вт 1% [0805]; Manufacturer Part: R0805; spicePre: R; spiceSymbolName: Резистор 12кОм 0,125Вт 1% [0805]; Add into BOM: yes; FootprintName: R0805; ModelName: R0805
R606 = Резистор 301кОм 0.25Вт 1% [1206]: Origin Footprint: R1206; Contributor: jordanjin; Convert to PCB: yes; UniqueId: ggeea1283e9dc2969a1; Device: Резистор 301кОм 0.25Вт 1% [1206]; Symbol: Резистор 301кОм 0.25Вт 1% [1206]; Manufacturer Part: R1206; spicePre: R; spiceSymbolName: Резистор 12кОм 0,25Вт 1% [1206]; Add into BOM: yes; FootprintName: R1206
R607 = Резистор 51кОм 0,125Вт 1% [0805]: Contributor: jordanjin; Convert to PCB: yes; UniqueId: gge56e73e21c5524884; ModelId: de27d504f5024d53a3020ec2611f5e5e; Origin Footprint: R0805; Device: Резистор 51кОм 0,125Вт 1% [0805]; Symbol: Резистор 51кОм 0,125Вт 1% [0805]; Manufacturer Part: R0805; spicePre: R; spiceSymbolName: Резистор 12кОм 0,125Вт 1% [0805]; Add into BOM: yes; FootprintName: R0805; ModelName: R0805
R608 = Резистор 12кОм 0,125Вт 1% [0805]: Contributor: jordanjin; Convert to PCB: yes; UniqueId: gge7fc67ad01ef7507c; ModelId: de27d504f5024d53a3020ec2611f5e5e; Origin Footprint: R0805; Device: Резистор 12кОм 0,125Вт 1% [0805]; Symbol: Резистор 12кОм 0,125Вт 1% [0805]; Manufacturer Part: R0805; spicePre: R; spiceSymbolName: Резистор 12кОм 0,125Вт 1% [0805]; Add into BOM: yes; FootprintName: R0805; ModelName: R0805
R609 = Резистор 33Ом 0,125Вт 1% [0805]: Contributor: jordanjin; Convert to PCB: yes; UniqueId: ggeb8f8df553e425e0e; ModelId: de27d504f5024d53a3020ec2611f5e5e; Origin Footprint: R0805; Device: Резистор 33Ом 0,125Вт 1% [0805]; Symbol: Резистор 33Ом 0,125Вт 1% [0805]; Manufacturer Part: R0805; spicePre: R; spiceSymbolName: Резистор 12кОм 0,125Вт 1% [0805]; Add into BOM: yes; FootprintName: R0805; ModelName: R0805
R610 = Резистор 33Ом 0,125Вт 1% [0805]: Contributor: jordanjin; Convert to PCB: yes; UniqueId: ggeabf0f57bec001b4b; ModelId: de27d504f5024d53a3020ec2611f5e5e; Origin Footprint: R0805; Device: Резистор 33Ом 0,125Вт 1% [0805]; Symbol: Резистор 33Ом 0,125Вт 1% [0805]; Manufacturer Part: R0805; spicePre: R; spiceSymbolName: Резистор 12кОм 0,125Вт 1% [0805]; Add into BOM: yes; FootprintName: R0805; ModelName: R0805
R611 = Резистор 150Ом 0,125Вт 1% [0805]: Origin Footprint: R0805; Contributor: jordanjin; Convert to PCB: yes; UniqueId: gge41f59506ff308f83; ModelId: de27d504f5024d53a3020ec2611f5e5e; Device: Резистор 150Ом 0,125Вт 1% [0805]; Symbol: Резистор 150Ом 0,125Вт 1% [0805]; Manufacturer Part: R0805; spicePre: R; spiceSymbolName: Резистор 12кОм 0,125Вт 1% [0805]; Add into BOM: yes; FootprintName: R0805; ModelName: R0805
R612 = Резистор 150Ом 0,125Вт 1% [0805]: Origin Footprint: R0805; Contributor: jordanjin; Convert to PCB: yes; UniqueId: gge40aa5aa735c5461f; ModelId: de27d504f5024d53a3020ec2611f5e5e; Device: Резистор 150Ом 0,125Вт 1% [0805]; Symbol: Резистор 150Ом 0,125Вт 1% [0805]; Manufacturer Part: R0805; spicePre: R; spiceSymbolName: Резистор 12кОм 0,125Вт 1% [0805]; Add into BOM: yes; FootprintName: R0805; ModelName: R0805
R613 = Резистор 5,1кОм 0,125Вт 1% [0805]: Contributor: jordanjin; Convert to PCB: yes; UniqueId: gge5a023fc275adfd8a; ModelId: de27d504f5024d53a3020ec2611f5e5e; Origin Footprint: R0805; Device: Резистор 5,1кОм 0,125Вт 1% [0805]; Symbol: Резистор 5,1кОм 0,125Вт 1% [0805]; Manufacturer Part: R0805; spicePre: R; spiceSymbolName: Резистор 12кОм 0,125Вт 1% [0805]; Add into BOM: yes; FootprintName: R0805; ModelName: R0805
R614 = Резистор 4,7кОм 0,125Вт 1% [0805]: Origin Footprint: R0805; Contributor: jordanjin; Convert to PCB: yes; UniqueId: gge50670e7ac8aeea98; ModelId: de27d504f5024d53a3020ec2611f5e5e; Device: Резистор 4,7кОм 0,125Вт 1% [0805]; Symbol: Резистор 4,7кОм 0,125Вт 1% [0805]; Manufacturer Part: R0805; spicePre: R; spiceSymbolName: Резистор 12кОм 0,125Вт 1% [0805]; Add into BOM: yes; FootprintName: R0805; ModelName: R0805
R615 = Резистор 820Ом 0,125Вт 1% [0805]: Contributor: jordanjin; Convert to PCB: yes; UniqueId: gge26ecdf9070edf343; ModelId: de27d504f5024d53a3020ec2611f5e5e; Origin Footprint: R0805; Device: Резистор 820Ом 0,125Вт 1% [0805]; Symbol: Резистор 820Ом 0,125Вт 1% [0805]; Manufacturer Part: R0805; spicePre: R; spiceSymbolName: Резистор 12кОм 0,125Вт 1% [0805]; Add into BOM: yes; FootprintName: R0805; ModelName: R0805
R616 = Резистор 2кОм 0,125Вт 1% [0805]: Contributor: jordanjin; Convert to PCB: yes; UniqueId: ggec0a6f3745d53e77c; ModelId: de27d504f5024d53a3020ec2611f5e5e; Origin Footprint: R0805; Device: Резистор 2кОм 0,125Вт 1% [0805]; Symbol: Резистор 2кОм 0,125Вт 1% [0805]; Manufacturer Part: R0805; spicePre: R; spiceSymbolName: Резистор 12кОм 0,125Вт 1% [0805]; Add into BOM: yes; FootprintName: R0805; ModelName: R0805
R617 = Резистор 200кОм 0,125Вт 1% [0805]: Contributor: jordanjin; Convert to PCB: yes; UniqueId: ggee550b56c43ee0264; ModelId: de27d504f5024d53a3020ec2611f5e5e; Origin Footprint: R0805; Device: Резистор 200кОм 0,125Вт 1% [0805]; Symbol: Резистор 200кОм 0,125Вт 1% [0805]; Manufacturer Part: R0805; spicePre: R; spiceSymbolName: Резистор 12кОм 0,125Вт 1% [0805]; Add into BOM: yes; FootprintName: R0805; ModelName: R0805
R618 = Резистор 820Ом 0,125Вт 1% [0805]: Contributor: jordanjin; Convert to PCB: yes; UniqueId: gge80fa684de9ffb113; ModelId: de27d504f5024d53a3020ec2611f5e5e; Origin Footprint: R0805; Device: Резистор 820Ом 0,125Вт 1% [0805]; Symbol: Резистор 820Ом 0,125Вт 1% [0805]; Manufacturer Part: R0805; spicePre: R; spiceSymbolName: Резистор 12кОм 0,125Вт 1% [0805]; Add into BOM: yes; FootprintName: R0805; ModelName: R0805
R619 = Резистор 2кОм 0,125Вт 1% [0805]: Contributor: jordanjin; Convert to PCB: yes; UniqueId: gge6ec5187a863efc02; ModelId: de27d504f5024d53a3020ec2611f5e5e; Origin Footprint: R0805; Device: Резистор 2кОм 0,125Вт 1% [0805]; Symbol: Резистор 2кОм 0,125Вт 1% [0805]; Manufacturer Part: R0805; spicePre: R; spiceSymbolName: Резистор 12кОм 0,125Вт 1% [0805]; Add into BOM: yes; FootprintName: R0805; ModelName: R0805
R620 = Резистор 300Ом 0,125Вт 1% [0805]: Contributor: jordanjin; Convert to PCB: yes; UniqueId: ggec2909b7a38843847; ModelId: de27d504f5024d53a3020ec2611f5e5e; Origin Footprint: R0805; Device: Резистор 300Ом 0,125Вт 1% [0805]; Symbol: Резистор 300Ом 0,125Вт 1% [0805]; Manufacturer Part: R0805; spicePre: R; spiceSymbolName: Резистор 12кОм 0,125Вт 1% [0805]; Add into BOM: yes; FootprintName: R0805; ModelName: R0805
R621 = Резистор 300Ом 0,125Вт 1% [0805]: Contributor: jordanjin; Convert to PCB: yes; UniqueId: gge72d79cb2dc0caeeb; ModelId: de27d504f5024d53a3020ec2611f5e5e; Origin Footprint: R0805; Device: Резистор 300Ом 0,125Вт 1% [0805]; Symbol: Резистор 300Ом 0,125Вт 1% [0805]; Manufacturer Part: R0805; spicePre: R; spiceSymbolName: Резистор 12кОм 0,125Вт 1% [0805]; Add into BOM: yes; FootprintName: R0805; ModelName: R0805
R622 = Резистор 300Ом 0,125Вт 1% [0805]: Contributor: jordanjin; Convert to PCB: yes; UniqueId: ggec87826da4cfd183e; ModelId: de27d504f5024d53a3020ec2611f5e5e; Origin Footprint: R0805; Device: Резистор 300Ом 0,125Вт 1% [0805]; Symbol: Резистор 300Ом 0,125Вт 1% [0805]; Manufacturer Part: R0805; spicePre: R; spiceSymbolName: Резистор 12кОм 0,125Вт 1% [0805]; Add into BOM: yes; FootprintName: R0805; ModelName: R0805
R623 = Резистор 10кОм 0.25Вт 1% [1206]: Contributor: jordanjin; Convert to PCB: yes; UniqueId: gge3a5e4f79c35eb04d; Origin Footprint: R1206; Device: Резистор 10кОм 0.25Вт 1% [1206]; Symbol: Резистор 10кОм 0.25Вт 1% [1206]; Manufacturer Part: R1206; spicePre: R; spiceSymbolName: Резистор 12кОм 0,25Вт 1% [1206]; Add into BOM: yes; FootprintName: R1206
R624 = Резистор 10кОм 0.25Вт 1% [1206]: Contributor: jordanjin; Convert to PCB: yes; UniqueId: ggeb76d304dc5b48f4d; Origin Footprint: R1206; Device: Резистор 10кОм 0.25Вт 1% [1206]; Symbol: Резистор 10кОм 0.25Вт 1% [1206]; Manufacturer Part: R1206; spicePre: R; spiceSymbolName: Резистор 12кОм 0,25Вт 1% [1206]; Add into BOM: yes; FootprintName: R1206
R625 = Резистор 10кОм 0.25Вт 1% [1206]: Contributor: jordanjin; Convert to PCB: yes; UniqueId: ggeb5d5375cf7011a26; Origin Footprint: R1206; Device: Резистор 10кОм 0.25Вт 1% [1206]; Symbol: Резистор 10кОм 0.25Вт 1% [1206]; Manufacturer Part: R1206; spicePre: R; spiceSymbolName: Резистор 12кОм 0,25Вт 1% [1206]; Add into BOM: yes; FootprintName: R1206
R626 = Резистор 10кОм 0.25Вт 1% [1206]: Contributor: jordanjin; Convert to PCB: yes; UniqueId: ggecab7c1446fad6f63; Origin Footprint: R1206; Device: Резистор 10кОм 0.25Вт 1% [1206]; Symbol: Резистор 10кОм 0.25Вт 1% [1206]; Manufacturer Part: R1206; spicePre: R; spiceSymbolName: Резистор 12кОм 0,25Вт 1% [1206]; Add into BOM: yes; FootprintName: R1206
R627 = Резистор 10кОм 0,125Вт 1% [0805]: Contributor: jordanjin; Convert to PCB: yes; UniqueId: gge94d5b7a7d0576a3f; ModelId: de27d504f5024d53a3020ec2611f5e5e; Origin Footprint: R0805; Device: Резистор 10кОм 0,125Вт 1% [0805]; Symbol: Резистор 10кОм 0,125Вт 1% [0805]; Manufacturer Part: R0805; spicePre: R; spiceSymbolName: Резистор 12кОм 0,125Вт 1% [0805]; Add into BOM: yes; FootprintName: R0805; ModelName: R0805
R628 = Резистор 10кОм 0,125Вт 1% [0805]: Contributor: jordanjin; Convert to PCB: yes; UniqueId: gge73851368ca55a977; ModelId: de27d504f5024d53a3020ec2611f5e5e; Origin Footprint: R0805; Device: Резистор 10кОм 0,125Вт 1% [0805]; Symbol: Резистор 10кОм 0,125Вт 1% [0805]; Manufacturer Part: R0805; spicePre: R; spiceSymbolName: Резистор 12кОм 0,125Вт 1% [0805]; Add into BOM: yes; FootprintName: R0805; ModelName: R0805
R629 = Резистор 470Ом 0,125Вт 1% [0805]: Contributor: jordanjin; Convert to PCB: yes; UniqueId: ggeb874a8de55068fb4; ModelId: de27d504f5024d53a3020ec2611f5e5e; Origin Footprint: R0805; Device: Резистор 470Ом 0,125Вт 1% [0805]; Symbol: Резистор 470Ом 0,125Вт 1% [0805]; Manufacturer Part: R0805; spicePre: R; spiceSymbolName: Резистор 12кОм 0,125Вт 1% [0805]; Add into BOM: yes; FootprintName: R0805; ModelName: R0805
R630 = Резистор 12кОм 0,125Вт 1% [0805]: Contributor: jordanjin; Convert to PCB: yes; UniqueId: ggecb19d0140942bf66; ModelId: de27d504f5024d53a3020ec2611f5e5e; Origin Footprint: R0805; Device: Резистор 12кОм 0,125Вт 1% [0805]; Symbol: Резистор 12кОм 0,125Вт 1% [0805]; Manufacturer Part: R0805; spicePre: R; spiceSymbolName: Резистор 12кОм 0,125Вт 1% [0805]; Add into BOM: yes; FootprintName: R0805; ModelName: R0805
R631 = Резистор 10кОм 0.25Вт 1% [1206]: Contributor: jordanjin; Convert to PCB: yes; UniqueId: gged6763fe3c6df9c5a; Origin Footprint: R1206; Device: Резистор 10кОм 0.25Вт 1% [1206]; Symbol: Резистор 10кОм 0.25Вт 1% [1206]; Manufacturer Part: R1206; spicePre: R; spiceSymbolName: Резистор 12кОм 0,25Вт 1% [1206]; Add into BOM: yes; FootprintName: R1206
R632 = Резистор 17,2кОм 0.25Вт 1% [1206]: Contributor: jordanjin; Convert to PCB: yes; UniqueId: ggedcd04cdd6fcbb72e; Origin Footprint: R1206; Device: Резистор 17,2кОм 0.25Вт 1% [1206]; Symbol: Резистор 17,2кОм 0.25Вт 1% [1206]; Manufacturer Part: R1206; spicePre: R; spiceSymbolName: Резистор 12кОм 0,25Вт 1% [1206]; Add into BOM: yes; FootprintName: R1206
R633 = Резистор 17,2кОм 0.25Вт 1% [1206]: Contributor: jordanjin; Convert to PCB: yes; UniqueId: gge9547ec5fb58540ec; Origin Footprint: R1206; Device: Резистор 17,2кОм 0.25Вт 1% [1206]; Symbol: Резистор 17,2кОм 0.25Вт 1% [1206]; Manufacturer Part: R1206; spicePre: R; spiceSymbolName: Резистор 12кОм 0,25Вт 1% [1206]; Add into BOM: yes; FootprintName: R1206
R634 = Резистор 10кОм 0.25Вт 1% [1206]: Contributor: jordanjin; Convert to PCB: yes; UniqueId: gge3b738eddb21e4e76; Origin Footprint: R1206; Device: Резистор 10кОм 0.25Вт 1% [1206]; Symbol: Резистор 10кОм 0.25Вт 1% [1206]; Manufacturer Part: R1206; spicePre: R; spiceSymbolName: Резистор 12кОм 0,25Вт 1% [1206]; Add into BOM: yes; FootprintName: R1206
R635 = Резистор 12кОм 0,125Вт 1% [0805]: Contributor: jordanjin; Convert to PCB: yes; UniqueId: gge67e268b3363a8ed4; ModelId: de27d504f5024d53a3020ec2611f5e5e; Origin Footprint: R0805; Device: Резистор 12кОм 0,125Вт 1% [0805]; Symbol: Резистор 12кОм 0,125Вт 1% [0805]; Manufacturer Part: R0805; spicePre: R; spiceSymbolName: Резистор 12кОм 0,125Вт 1% [0805]; Add into BOM: yes; FootprintName: R0805; ModelName: R0805
R636 = Резистор 10кОм 0.25Вт 1% [0805]: Contributor: jordanjin; Convert to PCB: yes; UniqueId: ggeb22dc21734e2a0a2; ModelId: de27d504f5024d53a3020ec2611f5e5e; Origin Footprint: R0805; Device: Резистор 10кОм 0.25Вт 1% [0805]; Symbol: Резистор 10кОм 0.25Вт 1% [0805]; Manufacturer Part: R0805; spicePre: R; spiceSymbolName: Резистор 12кОм 0,125Вт 1% [0805]; Add into BOM: yes; FootprintName: R0805; ModelName: R0805
R637 = Резистор 5,1кОм 0,125Вт 1% [0805]: Contributor: jordanjin; Convert to PCB: yes; UniqueId: gge29fbb60ab5c47728; ModelId: de27d504f5024d53a3020ec2611f5e5e; Origin Footprint: R0805; Device: Резистор 5,1кОм 0,125Вт 1% [0805]; Symbol: Резистор 5,1кОм 0,125Вт 1% [0805]; Manufacturer Part: R0805; spicePre: R; spiceSymbolName: Резистор 12кОм 0,125Вт 1% [0805]; Add into BOM: yes; FootprintName: R0805; ModelName: R0805
R638 = Резистор 10кОм 0.25Вт 1% [1206]: Contributor: jordanjin; Convert to PCB: yes; UniqueId: gge85a598c3af7ed5d4; Origin Footprint: R1206; Device: Резистор 10кОм 0.25Вт 1% [1206]; Symbol: Резистор 10кОм 0.25Вт 1% [1206]; Manufacturer Part: R1206; spicePre: R; spiceSymbolName: Резистор 12кОм 0,25Вт 1% [1206]; Add into BOM: yes; FootprintName: R1206
R639 = Резистор 4,99кОм 0.25Вт 1% [1206]: Contributor: jordanjin; Convert to PCB: yes; UniqueId: ggec424db209df0ef33; Origin Footprint: R1206; Device: Резистор 4,99кОм 0.25Вт 1% [1206]; Symbol: Резистор 4,99кОм 0.25Вт 1% [1206]; Manufacturer Part: R1206; spicePre: R; spiceSymbolName: Резистор 12кОм 0,25Вт 1% [1206]; Add into BOM: yes; FootprintName: R1206
R640 = Резистор 10кОм 0.25Вт 1% [1206]: Contributor: jordanjin; Convert to PCB: yes; UniqueId: gge924e646db2c26990; Origin Footprint: R1206; Device: Резистор 10кОм 0.25Вт 1% [1206]; Symbol: Резистор 10кОм 0.25Вт 1% [1206]; Manufacturer Part: R1206; spicePre: R; spiceSymbolName: Резистор 12кОм 0,25Вт 1% [1206]; Add into BOM: yes; FootprintName: R1206
R641 = Резистор 4,99кОм 0.25Вт 1% [1206]: Contributor: jordanjin; Convert to PCB: yes; UniqueId: ggee44ca5bbd1f4fb17; Origin Footprint: R1206; Device: Резистор 4,99кОм 0.25Вт 1% [1206]; Symbol: Резистор 4,99кОм 0.25Вт 1% [1206]; Manufacturer Part: R1206; spicePre: R; spiceSymbolName: Резистор 12кОм 0,25Вт 1% [1206]; Add into BOM: yes; FootprintName: R1206
R642 = Резистор 10кОм 0.25Вт 1% [1206]: Contributor: jordanjin; Convert to PCB: yes; UniqueId: gge4426f4b245fcb0be; Origin Footprint: R1206; Device: Резистор 10кОм 0.25Вт 1% [1206]; Symbol: Резистор 10кОм 0.25Вт 1% [1206]; Manufacturer Part: R1206; spicePre: R; spiceSymbolName: Резистор 12кОм 0,25Вт 1% [1206]; Add into BOM: yes; FootprintName: R1206
R643 = Резистор 24кОм 0,125Вт 1% [0805]: Contributor: jordanjin; Convert to PCB: yes; UniqueId: gge44f9e0f9b301705b; ModelId: de27d504f5024d53a3020ec2611f5e5e; Origin Footprint: R0805; Device: Резистор 24кОм 0,125Вт 1% [0805]; Symbol: Резистор 24кОм 0,125Вт 1% [0805]; Manufacturer Part: R0805; spicePre: R; spiceSymbolName: Резистор 12кОм 0,125Вт 1% [0805]; Add into BOM: yes; FootprintName: R0805; ModelName: R0805
R644 = Резистор 4,7кОм 0,125Вт 1% [0805]: Contributor: jordanjin; Convert to PCB: yes; UniqueId: gge3359f44cd81f3719; ModelId: de27d504f5024d53a3020ec2611f5e5e; Origin Footprint: R0805; Device: Резистор 4,7кОм 0,125Вт 1% [0805]; Symbol: Резистор 4,7кОм 0,125Вт 1% [0805]; Manufacturer Part: R0805; spicePre: R; spiceSymbolName: Резистор 12кОм 0,125Вт 1% [0805]; Add into BOM: yes; FootprintName: R0805; ModelName: R0805
R645 = Резистор 4,7кОм 0,125Вт 1% [0805]: Contributor: jordanjin; Convert to PCB: yes; UniqueId: ggeec23f9db4922fe85; ModelId: de27d504f5024d53a3020ec2611f5e5e; Origin Footprint: R0805; Device: Резистор 4,7кОм 0,125Вт 1% [0805]; Symbol: Резистор 4,7кОм 0,125Вт 1% [0805]; Manufacturer Part: R0805; spicePre: R; spiceSymbolName: Резистор 12кОм 0,125Вт 1% [0805]; Add into BOM: yes; FootprintName: R0805; ModelName: R0805
R646 = Резистор 12кОм 0,125Вт 1% [0805]: Contributor: jordanjin; Convert to PCB: yes; UniqueId: gge39fe5661104f6394; ModelId: de27d504f5024d53a3020ec2611f5e5e; Origin Footprint: R0805; Device: Резистор 12кОм 0,125Вт 1% [0805]; Symbol: Резистор 12кОм 0,125Вт 1% [0805]; Manufacturer Part: R0805; spicePre: R; spiceSymbolName: Резистор 12кОм 0,125Вт 1% [0805]; Add into BOM: yes; FootprintName: R0805; ModelName: R0805
R649 = Резистор 2кОм 0.25Вт 1% [1206]: Contributor: jordanjin; Convert to PCB: yes; UniqueId: gge82e20d64e8814dd7; Origin Footprint: R1206; Device: Резистор 2кОм 0.25Вт 1% [1206]; Symbol: Резистор 2кОм 0.25Вт 1% [1206]; Manufacturer Part: R1206; spicePre: R; spiceSymbolName: Резистор 12кОм 0,25Вт 1% [1206]; Add into BOM: yes; FootprintName: R1206
R650 = Резистор 2кОм 0.25Вт 1% [1206]: Contributor: jordanjin; Convert to PCB: yes; UniqueId: ggea6a906233ad70946; Origin Footprint: R1206; Device: Резистор 2кОм 0.25Вт 1% [1206]; Symbol: Резистор 2кОм 0.25Вт 1% [1206]; Manufacturer Part: R1206; spicePre: R; spiceSymbolName: Резистор 12кОм 0,25Вт 1% [1206]; Add into BOM: yes; FootprintName: R1206
R653 = Резистор 3,3кОм 0,125Вт 1% [0805]: Contributor: jordanjin; Convert to PCB: yes; UniqueId: ggeb9ffcc920bf386fb; ModelId: de27d504f5024d53a3020ec2611f5e5e; Origin Footprint: R0805; Device: Резистор 3,3кОм 0,125Вт 1% [0805]; Symbol: Резистор 3,3кОм 0,125Вт 1% [0805]; Manufacturer Part: R0805; spicePre: R; spiceSymbolName: Резистор 12кОм 0,125Вт 1% [0805]; Add into BOM: yes; FootprintName: R0805; ModelName: R0805
VD601 = Стабилитрон MMSZ5230B 4.7В 0.5Вт [SOD123]: Manufacturer: CJ(江苏长电/长晶); Convert to PCB: yes; UniqueId: gge3b8e8819d0016a0e; ModelId: 560a7cf99d0e44cb9af362aaf5d7923d; Origin Footprint: SOD-123_L2.8-W1.8-LS3.7-RD; Device: Стабилитрон MMSZ5230B 4.7В 0.5Вт [SOD123]; Symbol: Стабилитрон MMSZ5230B 4.7В 0.5Вт [SOD123]; Supplier: LCSC; Manufacturer Part: MMSZ5230B; Supplier Part: C21553; JLCPCB Part Class: Extended Part; spicePre: Z; spiceSymbolName: MMSZ5230B; Add into BOM: yes; FootprintName: SOD-123_L2.8-W1.8-LS3.7-RD; ModelName: SOD-123_L2.8-W1.8-LS3.7-RD
VD602 = Стабилитрон MMSZ5232B 5.6В 0.5Вт [SOD123]: Manufacturer: MCC(美微科); Manufacturer Part: MMSZ5232B-TP; Contributor: LCSC; Convert to PCB: yes; UniqueId: ggea1bdb1423b1290d6; Origin Footprint: SOD-123_L2.7-W1.6-LS3.7-RD; Device: Стабилитрон MMSZ5232B 5.6В 0.5Вт [SOD123]; Symbol: Стабилитрон MMSZ5232B 5.6В 0.5Вт [SOD123]; Supplier: LCSC; Supplier Part: C668974; JLCPCB Part Class: Extended Part; spicePre: D; spiceSymbolName: MMSZ5232B-TP; Add into BOM: yes; FootprintName: SOD-123_L2.7-W1.6-LS3.7-RD
VD603 = Стабилитрон MMSZ5232B 5.6В 0.5Вт [SOD123]: Manufacturer: MCC(美微科); Manufacturer Part: MMSZ5232B-TP; Contributor: LCSC; Convert to PCB: yes; UniqueId: gge16930576b8b59bdb; Origin Footprint: SOD-123_L2.7-W1.6-LS3.7-RD; Device: Стабилитрон MMSZ5232B 5.6В 0.5Вт [SOD123]; Symbol: Стабилитрон MMSZ5232B 5.6В 0.5Вт [SOD123]; Supplier: LCSC; Supplier Part: C668974; JLCPCB Part Class: Extended Part; spicePre: D; spiceSymbolName: MMSZ5232B-TP; Add into BOM: yes; FootprintName: SOD-123_L2.7-W1.6-LS3.7-RD
VD604 = Диод JPAD50 [SOT-23]: Manufacturer: Calogic; Contributor: jordanjin; Convert to PCB: yes; UniqueId: gge95b610f2389dff5a; ModelId: b6ca209a251f42989336735ebf9446b9; Origin Footprint: SOT-23-3_L3.0-W1.6-P1.90-LS2.8-L; Device: Диод JPAD50 [SOT-23]; Symbol: Диод JPAD50 [SOT-23]; Supplier: LCSC; Manufacturer Part: JPAD50; JLCPCB Part Class: Extended Part; spicePre: V; spiceSymbolName: Диод JPAD50 [SOT-23]; Add into BOM: yes; FootprintName: SOT-23-3_L3.0-W1.6-P1.90-LS2.8-L; ModelName: SOT-23-3_L3.0-W1.6-P1.90-LS2.8-L
VD605 = Диод JPAD50 [SOT-23]: Manufacturer: Calogic; Contributor: jordanjin; Convert to PCB: yes; UniqueId: gge11367b5b4a96ccef; ModelId: b6ca209a251f42989336735ebf9446b9; Origin Footprint: SOT-23-3_L3.0-W1.6-P1.90-LS2.8-L; Device: Диод JPAD50 [SOT-23]; Symbol: Диод JPAD50 [SOT-23]; Supplier: LCSC; Manufacturer Part: JPAD50; JLCPCB Part Class: Extended Part; spicePre: V; spiceSymbolName: Диод JPAD50 [SOT-23]; Add into BOM: yes; FootprintName: SOT-23-3_L3.0-W1.6-P1.90-LS2.8-L; ModelName: SOT-23-3_L3.0-W1.6-P1.90-LS2.8-L
VD606 = Диод JPAD50 [SOT-23]: Manufacturer: Calogic; Contributor: jordanjin; Convert to PCB: yes; UniqueId: gge598c18b5ecf44853; ModelId: b6ca209a251f42989336735ebf9446b9; Origin Footprint: SOT-23-3_L3.0-W1.6-P1.90-LS2.8-L; Device: Диод JPAD50 [SOT-23]; Symbol: Диод JPAD50 [SOT-23]; Supplier: LCSC; Manufacturer Part: JPAD50; JLCPCB Part Class: Extended Part; spicePre: V; spiceSymbolName: Диод JPAD50 [SOT-23]; Add into BOM: yes; FootprintName: SOT-23-3_L3.0-W1.6-P1.90-LS2.8-L; ModelName: SOT-23-3_L3.0-W1.6-P1.90-LS2.8-L
VD607 = Диод JPAD50 [SOT-23]: Manufacturer: Calogic; Contributor: jordanjin; Convert to PCB: yes; UniqueId: gge2e68016ab3ca0836; ModelId: b6ca209a251f42989336735ebf9446b9; Origin Footprint: SOT-23-3_L3.0-W1.6-P1.90-LS2.8-L; Device: Диод JPAD50 [SOT-23]; Symbol: Диод JPAD50 [SOT-23]; Supplier: LCSC; Manufacturer Part: JPAD50; JLCPCB Part Class: Extended Part; spicePre: V; spiceSymbolName: Диод JPAD50 [SOT-23]; Add into BOM: yes; FootprintName: SOT-23-3_L3.0-W1.6-P1.90-LS2.8-L; ModelName: SOT-23-3_L3.0-W1.6-P1.90-LS2.8-L
VD608 = Стабилитрон MMSZ5223B 2.7В 0.5Вт [SOD123]: Manufacturer: CJ; Convert to PCB: yes; UniqueId: ggeed0908ba25f18c6a; ModelId: 560a7cf99d0e44cb9af362aaf5d7923d; Origin Footprint: SOD-123_L2.8-W1.8-LS3.7-RD; Device: Стабилитрон MMSZ5223B 2.7В 0.5Вт [SOD123]; Symbol: Стабилитрон MMSZ5223B 2.7В 0.5Вт [SOD123]; Supplier: LCSC; Manufacturer Part: MMSZ5223B; Supplier Part: C21556; JLCPCB Part Class: Extended Part; spicePre: Z; spiceSymbolName: MMSZ5234B; Add into BOM: yes; FootprintName: SOD-123_L2.8-W1.8-LS3.7-RD; ModelName: SOD-123_L2.8-W1.8-LS3.7-RD
VD609 = Стабилитрон MMSZ5223B 2.7В 0.5Вт [SOD123]: Manufacturer: CJ; Convert to PCB: yes; UniqueId: gge75b600da1a7e87a0; ModelId: 560a7cf99d0e44cb9af362aaf5d7923d; Origin Footprint: SOD-123_L2.8-W1.8-LS3.7-RD; Device: Стабилитрон MMSZ5223B 2.7В 0.5Вт [SOD123]; Symbol: Стабилитрон MMSZ5223B 2.7В 0.5Вт [SOD123]; Supplier: LCSC; Manufacturer Part: MMSZ5223B; Supplier Part: C21556; JLCPCB Part Class: Extended Part; spicePre: Z; spiceSymbolName: MMSZ5234B; Add into BOM: yes; FootprintName: SOD-123_L2.8-W1.8-LS3.7-RD; ModelName: SOD-123_L2.8-W1.8-LS3.7-RD
VD610 = Стабилитрон MMSZ5234B 6.2В 0.5Вт [SOD123]: Manufacturer: CJ; Convert to PCB: yes; UniqueId: gge88df75bcbc9c00fa; ModelId: 560a7cf99d0e44cb9af362aaf5d7923d; Origin Footprint: SOD-123_L2.8-W1.8-LS3.7-RD; Device: Стабилитрон MMSZ5234B 6.2В 0.5Вт [SOD123]; Symbol: Стабилитрон MMSZ5234B 6.2В 0.5Вт [SOD123]; Supplier: LCSC; Manufacturer Part: MMSZ5234B; Supplier Part: C21556; JLCPCB Part Class: Extended Part; spicePre: Z; spiceSymbolName: MMSZ5234B; Add into BOM: yes; FootprintName: SOD-123_L2.8-W1.8-LS3.7-RD; ModelName: SOD-123_L2.8-W1.8-LS3.7-RD
VD611 = Стабилитрон MMSZ5234B 6.2В 0.5Вт [SOD123]: Manufacturer: CJ; Convert to PCB: yes; UniqueId: gge0b24766af8d30be4; ModelId: 560a7cf99d0e44cb9af362aaf5d7923d; Origin Footprint: SOD-123_L2.8-W1.8-LS3.7-RD; Device: Стабилитрон MMSZ5234B 6.2В 0.5Вт [SOD123]; Symbol: Стабилитрон MMSZ5234B 6.2В 0.5Вт [SOD123]; Supplier: LCSC; Manufacturer Part: MMSZ5234B; Supplier Part: C21556; JLCPCB Part Class: Extended Part; spicePre: Z; spiceSymbolName: MMSZ5234B; Add into BOM: yes; FootprintName: SOD-123_L2.8-W1.8-LS3.7-RD; ModelName: SOD-123_L2.8-W1.8-LS3.7-RD
VD612 = Стабилитрон MMSZ5234B 6.2В 0.5Вт [SOD123]: Manufacturer: CJ; Convert to PCB: yes; UniqueId: gge7c8a2aa1db39092d; ModelId: 560a7cf99d0e44cb9af362aaf5d7923d; Origin Footprint: SOD-123_L2.8-W1.8-LS3.7-RD; Device: Стабилитрон MMSZ5234B 6.2В 0.5Вт [SOD123]; Symbol: Стабилитрон MMSZ5234B 6.2В 0.5Вт [SOD123]; Supplier: LCSC; Manufacturer Part: MMSZ5234B; Supplier Part: C21556; JLCPCB Part Class: Extended Part; spicePre: Z; spiceSymbolName: MMSZ5234B; Add into BOM: yes; FootprintName: SOD-123_L2.8-W1.8-LS3.7-RD; ModelName: SOD-123_L2.8-W1.8-LS3.7-RD
VD613 = Стабилитрон MMSZ5234B 6.2В 0.5Вт [SOD123]: Manufacturer: CJ; Convert to PCB: yes; UniqueId: ggeaff4ab553a2d38b1; ModelId: 560a7cf99d0e44cb9af362aaf5d7923d; Origin Footprint: SOD-123_L2.8-W1.8-LS3.7-RD; Device: Стабилитрон MMSZ5234B 6.2В 0.5Вт [SOD123]; Symbol: Стабилитрон MMSZ5234B 6.2В 0.5Вт [SOD123]; Supplier: LCSC; Manufacturer Part: MMSZ5234B; Supplier Part: C21556; JLCPCB Part Class: Extended Part; spicePre: Z; spiceSymbolName: MMSZ5234B; Add into BOM: yes; FootprintName: SOD-123_L2.8-W1.8-LS3.7-RD; ModelName: SOD-123_L2.8-W1.8-LS3.7-RD
VD614 = Диод импульсный 1N4448 [SOD-123]: Manufacturer: YANGJIE; Manufacturer Part: 1N4448WQ; Contributor: jordanjin; Convert to PCB: yes; UniqueId: gge37c816c3320bdafc; ModelId: 5a61cd31046d4447ba73169a45a0935b; Origin Footprint: SOD-123_L2.7-W1.6-LS3.7-RD-1; Device: Диод импульсный 1N4448 [SOD-123]; Symbol: Диод импульсный 1N4448 [SOD-123]; Supplier: LCSC; JLCPCB Part Class: Extended Part; spicePre: V; spiceSymbolName: Диод импульсный 1N4448 [SOD-123]; Add into BOM: yes; FootprintName: SOD-123_L2.7-W1.6-LS3.7-RD-1; ModelName: SOD-123_L2.7-W1.6-LS3.7-RD-1
VD615 = Диод импульсный 1N4448 [SOD-123]: Manufacturer: YANGJIE; Manufacturer Part: 1N4448WQ; Contributor: jordanjin; Convert to PCB: yes; UniqueId: gge04314e08350ec828; ModelId: 5a61cd31046d4447ba73169a45a0935b; Origin Footprint: SOD-123_L2.7-W1.6-LS3.7-RD-1; Device: Диод импульсный 1N4448 [SOD-123]; Symbol: Диод импульсный 1N4448 [SOD-123]; Supplier: LCSC; JLCPCB Part Class: Extended Part; spicePre: V; spiceSymbolName: Диод импульсный 1N4448 [SOD-123]; Add into BOM: yes; FootprintName: SOD-123_L2.7-W1.6-LS3.7-RD-1; ModelName: SOD-123_L2.7-W1.6-LS3.7-RD-1